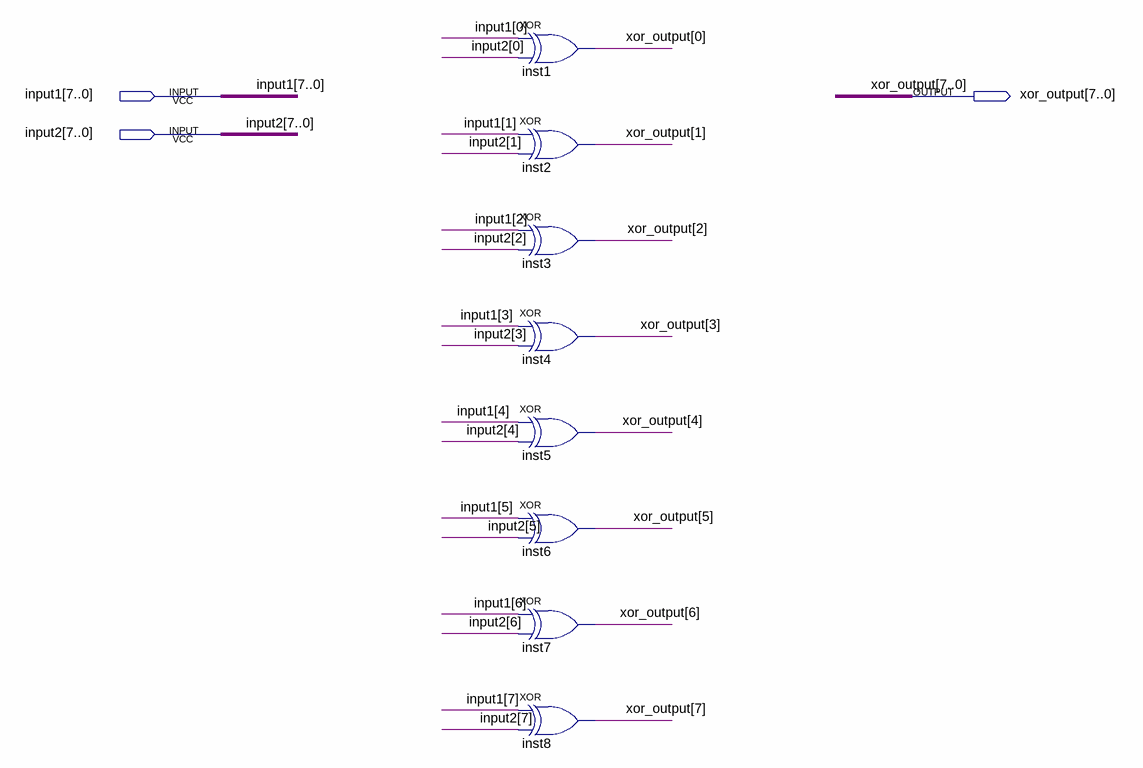
[diagram p0: schematic sheet]
// Quartus schematic XOR_8bit.bdf as structural Verilog: 8 symbols, 3 pins
module XOR_8bit (
  input  [7:0] input1,
  input  [7:0] input2,
  output [7:0] xor_output
);

  xor inst1 (xor_output[0], input1[0], input2[0]);
  xor inst2 (xor_output[1], input1[1], input2[1]);
  xor inst3 (xor_output[2], input1[2], input2[2]);
  xor inst4 (xor_output[3], input1[3], input2[3]);
  xor inst5 (xor_output[4], input1[4], input2[4]);
  xor inst6 (xor_output[5], input1[5], input2[5]);
  xor inst7 (xor_output[6], input1[6], input2[6]);
  xor inst8 (xor_output[7], input1[7], input2[7]);
endmodule
